# EAGLE design backup2 (EAGLE 5.11)
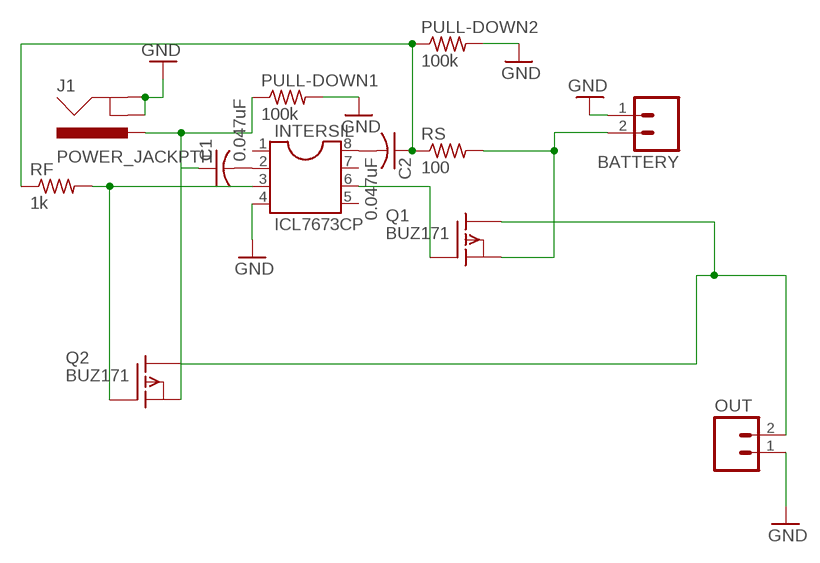
[diagram p0: schematic, sheet 1]

## Parts
BATTERY  M025MM  [SCREWTERMINAL-5MM-2]
C1  0.047uF  C-US025-025X050  [C025-025X050]
C2  0.047uF  C-US025-025X050  [C025-025X050]
INTERSIL  ICL7673CP  DIL8  [DIL08]
J1  POWER_JACKPTH  [POWER_JACK_PTH]
OUT  M025MM  [SCREWTERMINAL-5MM-2]
PULL-DOWN1  100k  R-US_0207/12  [0207/12]
PULL-DOWN2  100k  R-US_0207/12  [0207/12]
Q1  BUZ171  [TO220]
Q2  BUZ171  [TO220]
RF  1k  R-US_0207/7  [0207/7]
RS  100  R-US_0207/10  [0207/10]

## Nets
GND: BATTERY.1 INTERSIL.4 J1.GND J1.GNDBREAK OUT.1 PULL-DOWN1.2 PULL-DOWN2.2
N$1: C2.1 PULL-DOWN2.1 RF.1 RS.1
N$2: BATTERY.2 Q1.3(S) RS.2
N$3: INTERSIL.3 Q2.1(G) RF.2
N$4: OUT.2 Q1.2(D) Q2.2(D)
N$5: INTERSIL.6 Q1.1(G)
N$8: C1.1 J1.PWR PULL-DOWN1.1 Q2.3(S)
N$9: C1.2 INTERSIL.2
N$10: C2.2 INTERSIL.8
Unconnected: INTERSIL.1 INTERSIL.5 INTERSIL.7

## Library data of the parts
BATTERY OUT = SparkFun:M02: Header 2 Standard 2-pin 0.1" header. Use with straight break away headers (SKU : PRT-00116), right angle break away headers (PRT-00553), swiss pins (PRT-00743), machine pins (PRT-00117), and female headers (PRT-00115). Molex polarized connector foot print use with SKU : PRT-08233 with associated crimp pins and housings.
C1 C2 = rcl:C-US: CAPACITOR, American symbol
INTERSIL = ic-package:DIL8: Dual In Line / Socket
J1 = SparkFun:POWER_JACK: Power Jack This is the standard 5.5mm barrel jack for power. The PTH is the most common, proven, reliable, footprint. All others are experimental. The Slot footprint only works if the mill layer is transmitted to the PCB fab house so be warned. Spark Fun Electronics SKU : PRT-00119. Mating wall wart : TOL-00298 (and others)
PULL-DOWN1 PULL-DOWN2 RF RS = rcl:R-US_: RESISTOR, American symbol
Q1 Q2 = transistor-fet:BUZ171: P-Channel Enhancement MOSFET -50V; 7A; 0,4Ohm

## Board
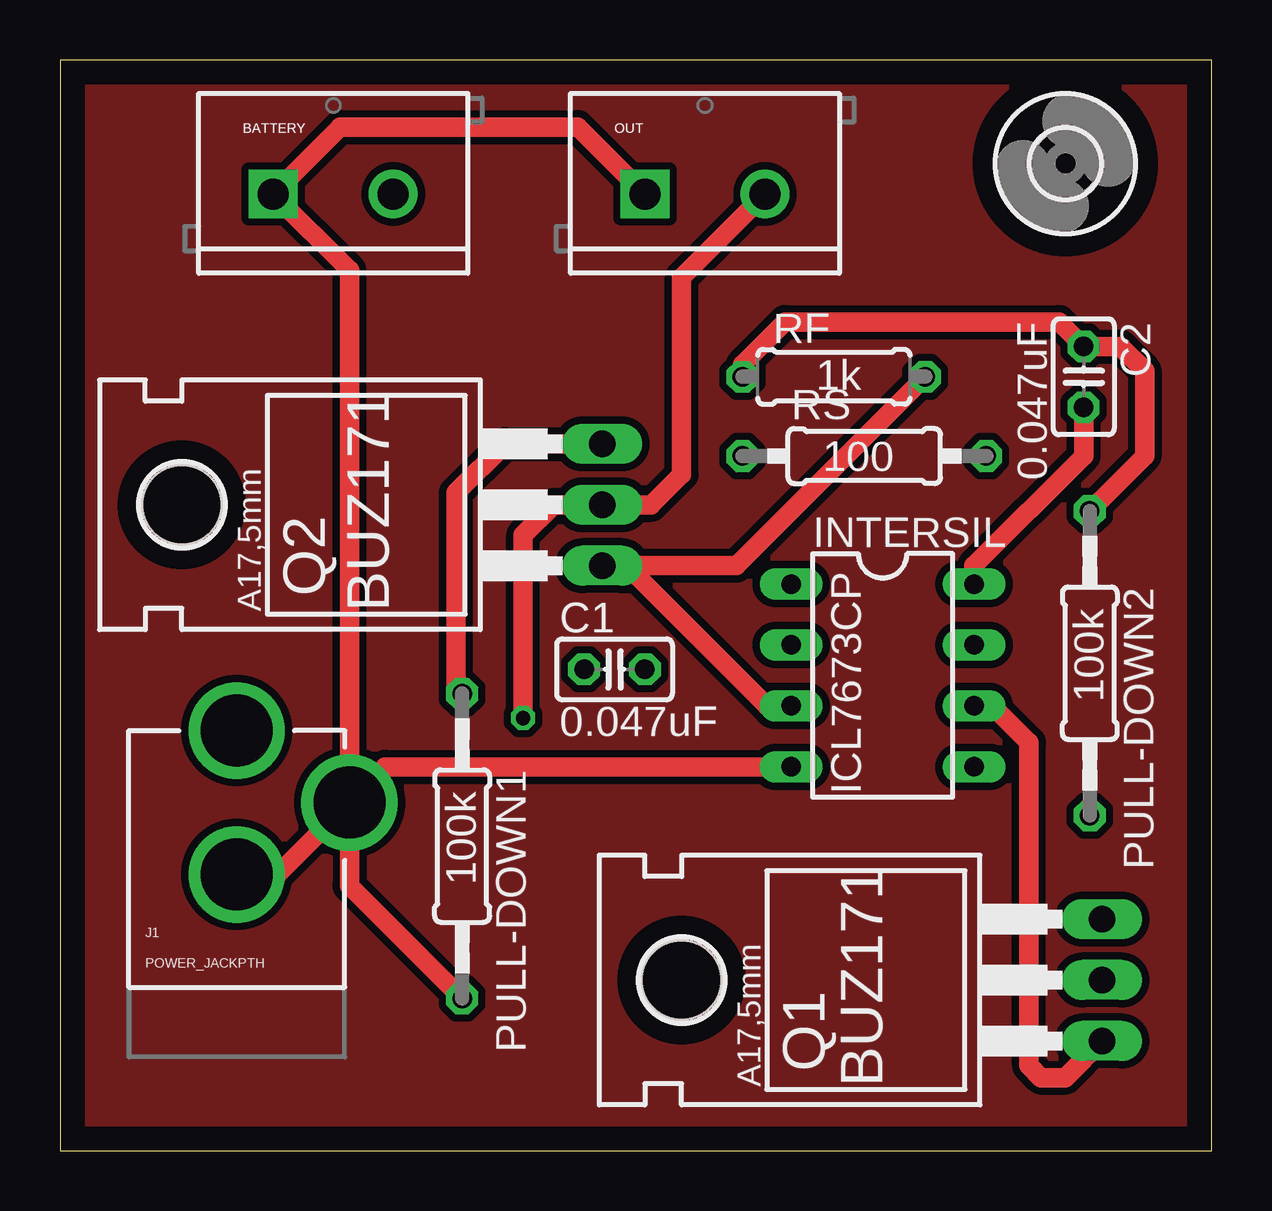
[diagram p1: board, top side]
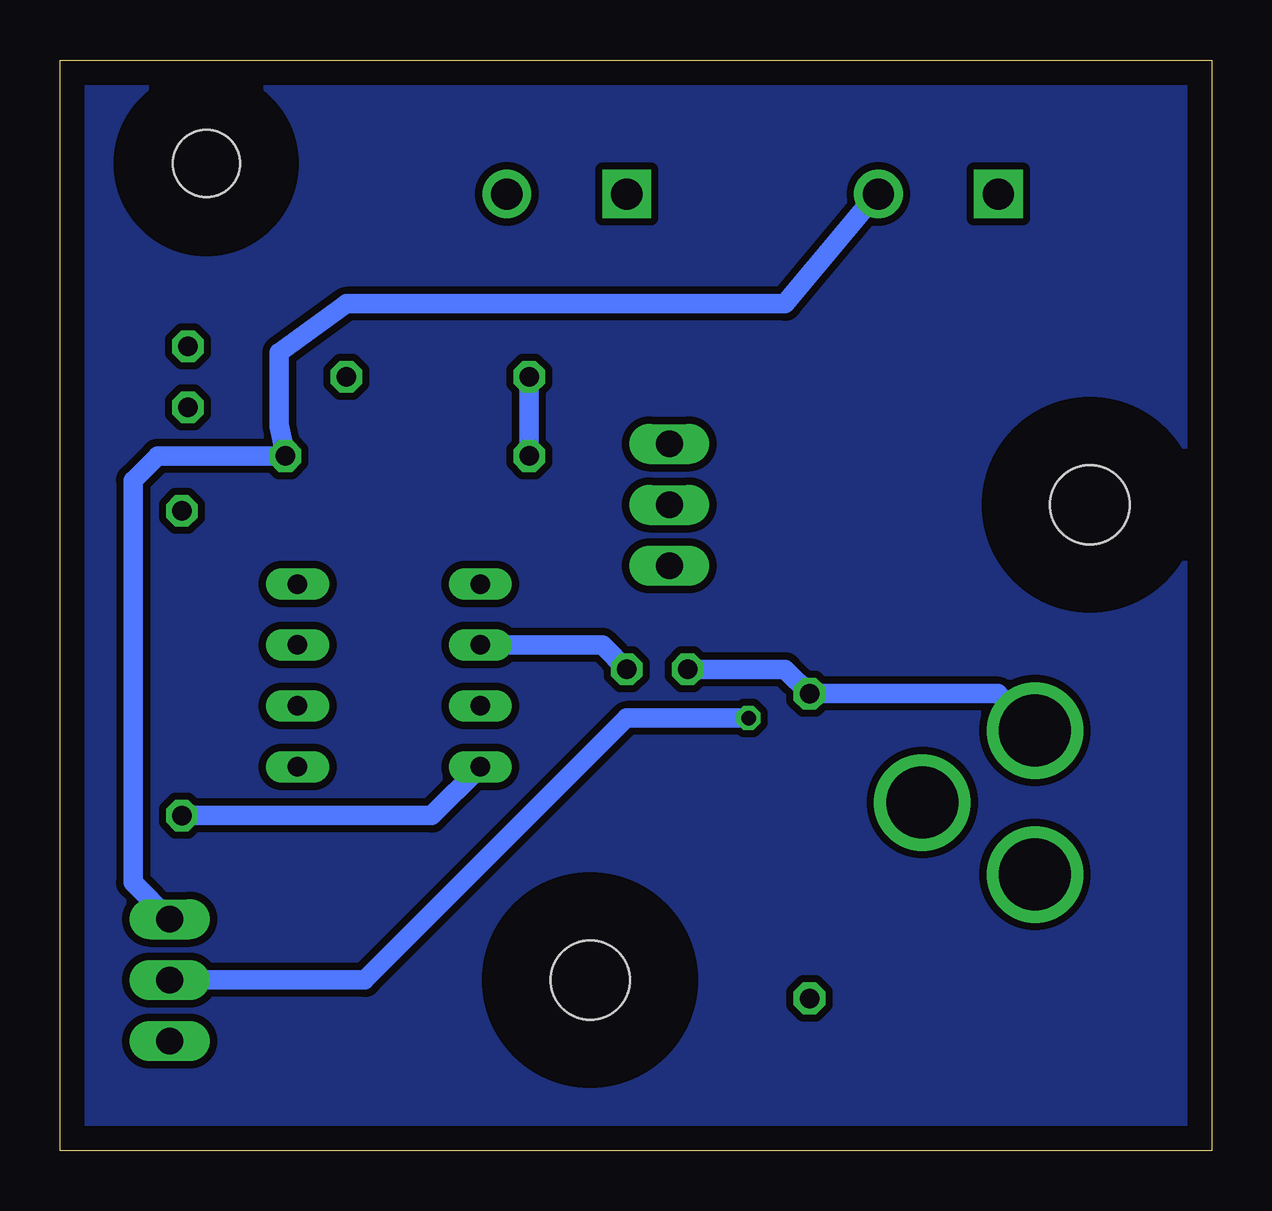
[diagram p2: board, bottom side, seen from below]

Size 48.01 x 45.47 mm. Coordinates in mm from the lower left corner, seen from the top.
Outline: 0,0 48.01,0 48.01,45.47 0,45.47 0,0
Copper layers (1*16): Top 0.035mm / dielectric 1.5mm / Bottom 0.035mm
Design rules "default": minimum track width 10mil, minimum drill 24mil, track to track 8mil, track to pad 8mil, pad to pad 8mil, via to via 8mil, smd to smd 8mil, copper to edge 40mil, drill to drill 8mil, minimum pad ring 10mil, minimum via ring 8mil, stop-mask expansion 4mil, vias tented up to drill 0mil, thermal gap 10mil

### Footprints (pad centres in the part's own frame; a part is rotated, then mirrored left to right if it is on the bottom)
SCREWTERMINAL-5MM-2 = drill 1.3 pad 2.032 square: 1 0,0 | drill 1.3 pad 2.032 round: 2 5,0
C025-025X050 = drill 0.813 octagon: 1 -1.27,0; 2 1.27,0
DIL08 = drill 0.813 long: 1 -3.81,-3.81; 2 -1.27,-3.81; 3 1.27,-3.81; 4 3.81,-3.81; 5 3.81,3.81; 6 1.27,3.81; 7 -1.27,3.81; 8 -3.81,3.81
POWER_JACK_PTH = drill 2.997 round: GND 0,7.7; GNDBREAK 4.7,10.7; PWR 0,13.7
0207/12 = drill 0.813 octagon: 1 -6.35,0; 2 6.35,0
TO220 = drill 1.118 long: 1 -2.54,-6.35; 2 0,-6.35; 3 2.54,-6.35 | hole 3.302: 0,11.176
0207/7 = drill 0.813 octagon: 1 -3.81,0; 2 3.81,0
0207/10 = drill 0.813 octagon: 1 -5.08,0; 2 5.08,0
2,8 = hole 2.8: 0,0

### Placement (x,y rotation side)
BATTERY  8.89,39.88 0 top
C1  23.11,20.07 0 top
C2  42.67,32.26 270 top
INTERSIL  34.29,19.81 270 top
J1  7.37,3.81 0 top
OUT  24.38,39.88 0 top
PULL-DOWN1  16.76,12.7 270 top
PULL-DOWN2  42.93,20.32 270 top
Q1  37.08,7.11 90 top
Q2  16.26,26.92 90 top
RF  32.26,32.26 0 top
RS  33.53,28.96 0 top
U$1  [2,8]  41.91,41.15 0 top

### Tracks (layer width: path | path; a pad name or v marks a point on that pad's centre or on a via)
GND
  Top 0.813: INTERSIL.4 13.56,16 J1.GNDBREAK | J1.GND 9.07,11.51 J1.GNDBREAK | J1.GNDBREAK 12.07,11.05 PULL-DOWN1.2 | J1.GNDBREAK 12.07,36.7 BATTERY.1 11.68,42.67 21.59,42.67 OUT.1
  Bottom 0.813: INTERSIL.4 32.51,13.97 PULL-DOWN2.2
N$1
  Top 0.813: RF.1 28.45,32.77 30.23,34.54 41.66,34.54 C2.1 44.2,33.53 45.21,32.51 45.21,28.96 PULL-DOWN2.1
  Bottom 0.813: RS.1 RF.1
N$2
  Bottom 0.813: BATTERY.2 13.97,39.88 17.78,35.31 36.07,35.31 38.86,33.27 38.86,30.23 RS.2 43.94,28.96 44.96,27.94 44.96,11.18 Q1.3
N$3
  Top 0.813: INTERSIL.3 29.46,18.54 23.62,24.38 | Q2.1 23.62,24.38 | 23.62,24.38 28.19,24.38 RF.2
N$4  (via drill 0.6)
  Top 0.813: OUT.2 25.91,36.4 25.91,28.19 24.64,26.92 Q2.2 20.57,26.92 19.3,25.65 v19.3,18.03
  Bottom 0.813: Q1.2 35.31,7.11 24.38,18.03 v19.3,18.03
N$5
  Top 0.813: INTERSIL.6 38.86,18.54 40.39,17.02 40.39,3.56 40.89,3.05 41.91,3.05 Q1.1
N$6
  pour Top (isolate 0.305): 0,45.47 0,0 48.01,0 48.01,45.47
N$7
  pour Bottom (isolate 0.305): 48.01,45.47 0,45.47 0,0 48.01,0
N$8
  Top 0.813: Q2.3 18.54,29.46 16.51,27.43 16.51,19.3 PULL-DOWN1.1
  Bottom 0.813: J1.PWR 8.91,19.05 PULL-DOWN1.1 17.78,20.07 C1.1
N$9
  Bottom 0.813: C1.2 25.4,21.08 INTERSIL.2
N$10
  Top 0.813: INTERSIL.8 38.1,24.38 42.67,28.96 C2.2

### Text on the board
_tsilk: BATTERY | OUT | 0.047uF | 1k | 100 | ICL7673CP | BUZ171 | 100k | 0.047uF | 100k | POWER_JACKPTH | BUZ171